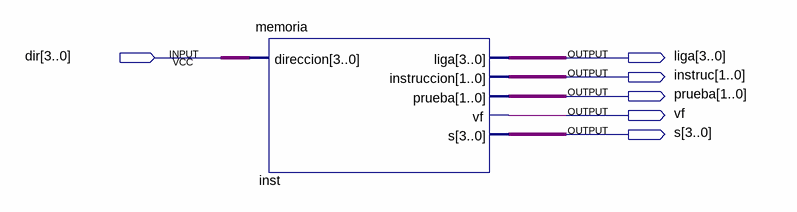
[diagram p0: schematic sheet]
// Quartus schematic mem.bdf as structural Verilog: 1 symbols, 6 pins
module mem (
  input  [3:0] dir,
  output [3:0] liga,
  output [1:0] instruc,
  output [1:0] prueba,
  output vf,
  output [3:0] s
);

  memoria inst (.direccion(dir), .liga(liga), .instruccion(instruc), .prueba(prueba), .vf(vf), .s(s));
endmodule
